# Altium schematic sheet RegisterB.schdoc
size 208 x 180 mm
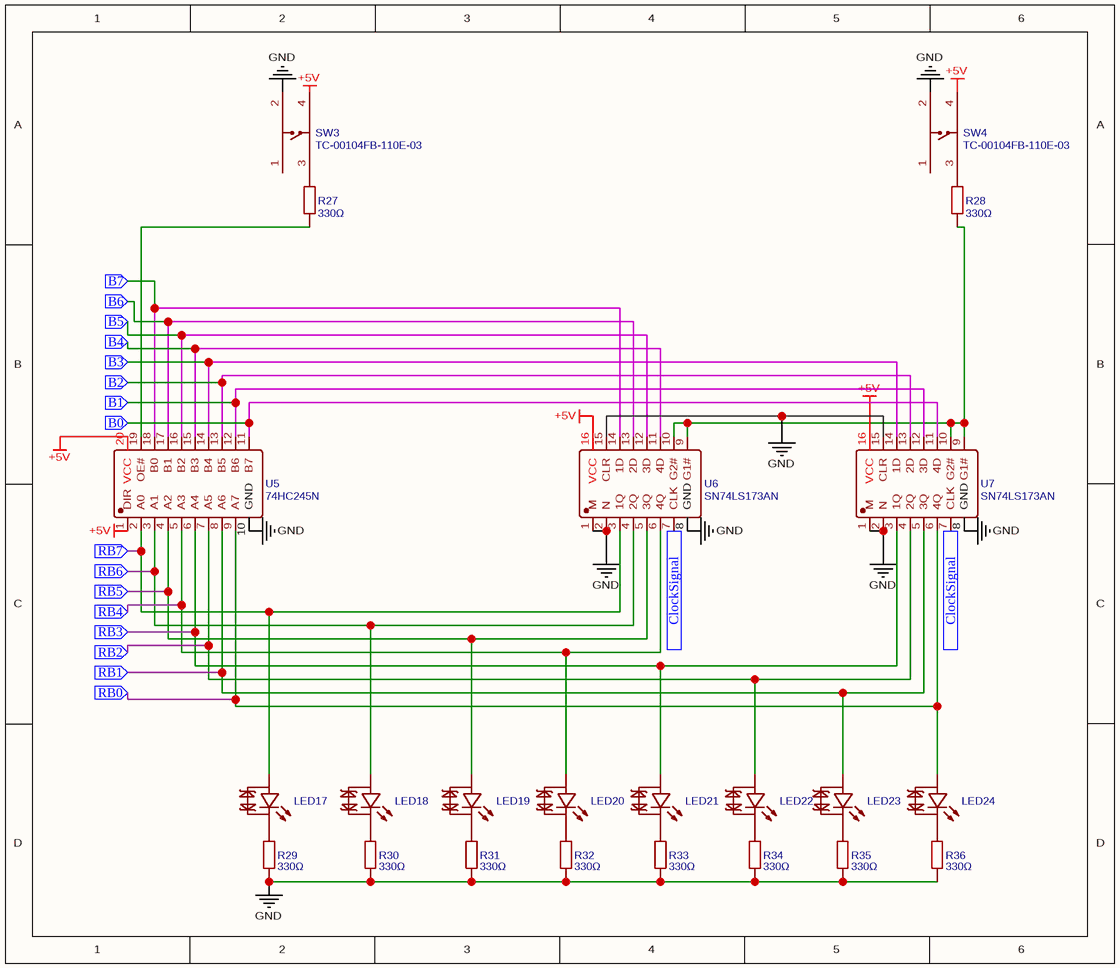
[diagram p0: RegisterB.schdoc]

## Parts
LED17  204-15UTC/S400-X9-L  [LED-TH_BD3.0-P2.54-FD]  (value not drawn)
LED18  204-15UTC/S400-X9-L  [LED-TH_BD3.0-P2.54-FD]  (value not drawn)
LED19  204-15UTC/S400-X9-L  [LED-TH_BD3.0-P2.54-FD]  (value not drawn)
LED20  204-15UTC/S400-X9-L  [LED-TH_BD3.0-P2.54-FD]  (value not drawn)
LED21  204-15UTC/S400-X9-L  [LED-TH_BD3.0-P2.54-FD]  (value not drawn)
LED22  204-15UTC/S400-X9-L  [LED-TH_BD3.0-P2.54-FD]  (value not drawn)
LED23  204-15UTC/S400-X9-L  [LED-TH_BD3.0-P2.54-FD]  (value not drawn)
LED24  204-15UTC/S400-X9-L  [LED-TH_BD3.0-P2.54-FD]  (value not drawn)
R27  330Ω  [RES-TH_BD3.3-L9.0-P13.00-D0.6]
R28  330Ω  [RES-TH_BD3.3-L9.0-P13.00-D0.6]
R29  330Ω  [RES-TH_BD3.3-L9.0-P13.00-D0.6]
R30  330Ω  [RES-TH_BD3.3-L9.0-P13.00-D0.6]
R31  330Ω  [RES-TH_BD3.3-L9.0-P13.00-D0.6]
R32  330Ω  [RES-TH_BD3.3-L9.0-P13.00-D0.6]
R33  330Ω  [RES-TH_BD3.3-L9.0-P13.00-D0.6]
R34  330Ω  [RES-TH_BD3.3-L9.0-P13.00-D0.6]
R35  330Ω  [RES-TH_BD3.3-L9.0-P13.00-D0.6]
R36  330Ω  [RES-TH_BD3.3-L9.0-P13.00-D0.6]
SW3  TC-00104FB-110E-03  [SW-TH_4P-L6.0-W6.0-P4.50-LS6.5]
SW4  TC-00104FB-110E-03  [SW-TH_4P-L6.0-W6.0-P4.50-LS6.5]
U5  74HC245N  [DIP-20_L26.8-W6.4-P2.54-LS7.6-BL]
U6  SN74LS173AN  [PDIP-16_L19.3-W6.4-P2.54-LS7.94-BL]
U7  SN74LS173AN  [PDIP-16_L19.3-W6.4-P2.54-LS7.94-BL]

## Ports
B0 (in), B1 (in), B2 (in), B3 (in), B4 (in), B5 (in), B6 (in), B7 (in), ClockSignal (in), RB0 (in), RB1 (in), RB2 (in), RB3 (in), RB4 (in), RB5 (in), RB6 (in), RB7 (in)

## Nets
+5V: SW4.4 U5.1(DIR) U5.20(VCC) U6.16(VCC) U7.16(VCC)
GND: R29.2 R30.2 R31.2 R32.2 R33.2 R34.2 R35.2 R36.2 SW3.2 SW4.2 U5.10(GND) U6.1(M) U6.2(N) U6.8(GND) U6.15(CLR) U7.1(M) U7.2(N) U7.8(GND) U7.15(CLR)
B0: U5.11(B7) U7.11(4D) ; port B0
B1: U5.12(B6) U7.12(3D) ; port B1
B2: U5.13(B5) U7.13(2D) ; port B2
B3: U5.14(B4) U7.14(1D) ; port B3
B4: U5.15(B3) U6.11(4D) ; port B4
B5: U5.16(B2) U6.12(3D) ; port B5
B6: U5.17(B1) U6.13(2D) ; port B6
B7: U5.18(B0) U6.14(1D) ; port B7
ClockSignal: U6.7(CLK) U7.7(CLK) ; port ClockSignal
RB0: LED24.1(A) U5.9(A7) U7.6(4Q) ; port RB0
RB1: LED23.1(A) U5.8(A6) U7.5(3Q) ; port RB1
RB2: LED22.1(A) U5.7(A5) U7.4(2Q) ; port RB2
RB3: LED21.1(A) U5.6(A4) U7.3(1Q) ; port RB3
RB4: LED20.1(A) U5.5(A3) U6.6(4Q) ; port RB4
RB5: LED19.1(A) U5.4(A2) U6.5(3Q) ; port RB5
RB6: LED18.1(A) U5.3(A1) U6.4(2Q) ; port RB6
RB7: LED17.1(A) U5.2(A0) U6.3(1Q) ; port RB7
NetLED17_2: LED17.2(C) R29.1
NetLED18_2: LED18.2(C) R30.1
NetLED19_2: LED19.2(C) R31.1
NetLED20_2: LED20.2(C) R32.1
NetLED21_2: LED21.2(C) R33.1
NetLED22_2: LED22.2(C) R34.1
NetLED23_2: LED23.2(C) R35.1
NetLED24_2: LED24.2(C) R36.1
NetR27_1: R27.1 U5.19(OE#)
NetR27_2: R27.2 SW3.3
NetR28_1: R28.1 U6.9(G1#) U6.10(G2#) U7.9(G1#) U7.10(G2#)
NetR28_2: R28.2 SW4.3

Not connected (* = marked no-connect by the designer): SW3 1 4; SW4 1

## Notes on the sheet
- Labels drawn without touching a wire or pin: +5V

## Library data of the parts
LED17-LED24 = 204-15UTC/S400-X9-L: Manufacturer: EVERLIGHT(亿光); Contributor: LCSC; Supplier: LCSC; Supplier Part: C282138; Manufacturer Part: 204-15UTC/S400-X9-L; JLCPCB Part Class: Extended Part; spicePre: L; spiceSymbolName: 204-15UTC/S400-X9-L
R27-R36 = 330Ω: Manufacturer: CCO(千志电子); Manufacturer Part: MF1/2W-0.1Ω±1% T; nameAlias: Value; Contributor: LCSC; Supplier: LCSC; Supplier Part: C119393; JLCPCB Part Class: Extended Part; spicePre: R; spiceSymbolName: MF1/2W-0.1Ω±1% T52
SW3 SW4 = TC-00104FB-110E-03: Manufacturer: HOOYA(皓宇电子); Contributor: lcsc; Supplier: LCSC; Supplier Part: C7542981; Manufacturer Part: TC-00104FB-110E-03; JLCPCB Part Class: Extended Part; spicePre: S; spiceSymbolName: TC-00104FB-110E-03
U5 = 74HC245N: Manufacturer: HGSEMI(华冠); Contributor: LCSC; Supplier: LCSC; Supplier Part: C507182; Manufacturer Part: 74HC245N; JLCPCB Part Class: Extended Part; spicePre: U; spiceSymbolName: 74HC245N
U6 U7 = SN74LS173AN: Manufacturer: TI(德州仪器); Contributor: LCSC; Supplier: LCSC; Supplier Part: C1550125; Manufacturer Part: SN74LS173AN; JLCPCB Part Class: Extended Part; spicePre: U; spiceSymbolName: SN74LS173AN